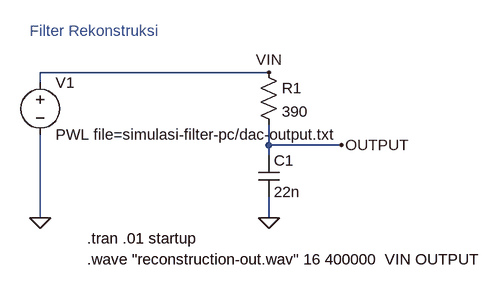
[diagram p0: schematic reconstruction-filter.asc]
reconstruction-filter.asc, the LTspice schematic file:
Version 4
SHEET 1 880 680
WIRE 80 64 -272 64
WIRE -272 80 -272 64
WIRE 80 176 80 144
WIRE 192 176 80 176
WIRE 80 192 80 176
WIRE -272 288 -272 160
WIRE 80 288 80 256
FLAG 192 176 OUTPUT
FLAG 80 288 0
FLAG -272 288 0
FLAG 80 64 VIN
SYMBOL res 64 48 R0
SYMATTR InstName R1
SYMATTR Value 390
SYMBOL cap 64 192 R0
SYMATTR InstName C1
SYMATTR Value 22n
SYMATTR SpiceLine V=4 Irms=0 Rser=0 Lser=0 mfg="   ---" pn="   ---" type="   ---"
SYMBOL voltage -272 64 R0
WINDOW 123 0 0 Left 0
WINDOW 39 0 0 Left 0
SYMATTR InstName V1
SYMATTR Value PWL file=simulasi-filter-pc/dac-output.txt
TEXT -200 320 Left 2 !.tran .01 startup
TEXT -200 352 Left 2 !.wave "reconstruction-out.wav" 16 400000  VIN OUTPUT
TEXT -288 0 Left 2 ;Filter Rekonstruksi

The netlist it stands for:
* reconstruction-filter.asc
R1 VIN OUTPUT 390
C1 OUTPUT 0 22n V=4 Irms=0 Rser=0 Lser=0 mfg="   ---" pn="   ---" type="   ---"
V1 VIN 0 PWL file=simulasi-filter-pc/dac-output.txt
.tran .01 startup
.wave "reconstruction-out.wav" 16 400000  VIN OUTPUT
* Filter Rekonstruksi
.backanno
.end